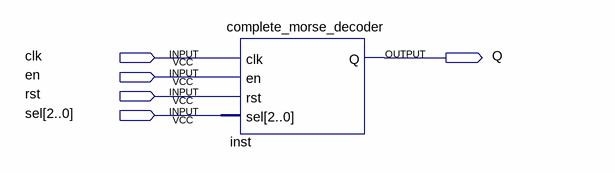
[diagram p0: schematic sheet]
// Quartus schematic Lab7Part4.bdf as structural Verilog: 1 symbols, 5 pins
module Lab7Part4 (
  input  clk,
  input  en,
  input  rst,
  input  [2:0] sel,
  output Q
);

  complete_morse_decoder inst (.clk(clk), .en(en), .rst(rst), .sel(sel), .Q(Q));
endmodule
